# Altium schematic sheet Tran_RF.SchDoc
size A
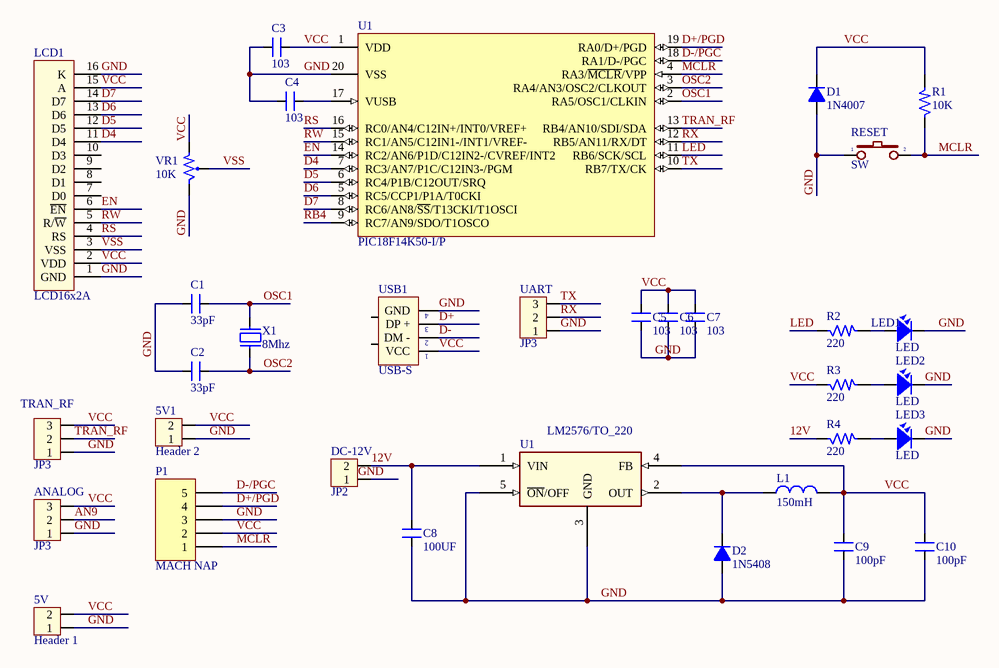
[diagram p0: Tran_RF.SchDoc]

## Parts
(Parts that share a designator on the sheet are numbered #1, #2 ... from top to bottom, then left to right.)
5V  Header 1  [HED2]
5V1  Header 2  [HED2]
ANALOG  JP3  [CON3]
C1  33pF  [SM-0805]
C2  33pF  [SM-0805]
C3  103  [SM-0805]
C4  103  [SM-0805]
C5  103  [SM-0805]
C6  103  [SM-0805]
C7  103  [SM-0805]
C8  100UF  [CP-SMD]
C9  100pF  [CP-SMD]
C10  100pF  [SM-1206]
D1  1N4007  [D1A]
D2  1N5408  [D2AN]
DC-12V  JP2  [CON2]
L1  150mH  [L/0.4]
LCD1  LCD16x2A  [LCD16X2]
LED1  LED  [Led-SMD]
LED2  LED  [Led-SMD]
LED3  LED  [Led-SMD]
P1  MACH NAP  [CON5]
R1  10K  [SM-0805]
R2  220  [SM-0805]
R3  220  [SM-0805]
R4  220  [SM-0805]
RESET  SW  [SW2]
TRAN_RF  JP3  [CON3]
U1#1  PIC18F14K50-I/P  [SOP-20]
U1#2  LM2576/TO_220  [LM2576_SMD]
UART  JP3  [CON3]
USB1  USB-S  [USB-A-RA]
VR1  10K  [VR]
X1  8Mhz  [XT2]

## Nets
12V: C8.2 DC-12V.2 R4.1 U1#2.1(VIN)
AN9: ANALOG.2
D4: LCD1.11(D4) U1#1.7(RC3/AN7/P1C/C12IN3-/PGM)
D5: LCD1.12(D5) U1#1.6(RC4/P1B/C12OUT/SRQ)
D6: LCD1.13(D6) U1#1.5(RC5/CCP1/P1A/T0CKI)
D7: LCD1.14(D7) U1#1.8(RC6/AN8/~{SS}/T13CKI/T1OSCI)
D+: USB1.3(DP_+)
D+/PGD: P1.4 U1#1.19(RA0/D+/PGD)
D-: USB1.2(DM_-)
D-/PGC: P1.5 U1#1.18(RA1/D-/PGC)
EN: LCD1.6(~{EN}) U1#1.14(RC2/AN6/P1D/C12IN2-/CVREF/INT2)
GND: 5V.1 5V1.1 ANALOG.1 C1.1 C2.1 C3.1 C4.1 C5.1 C6.1 C7.1 C8.1 C9.1 C10.1 D1.1(A) D2.1(A) LCD1.1(GND) LCD1.16(K) LED1.2 LED2.2 LED3.2 P1.3 RESET.1 TRAN_RF.1 U1#1.20(VSS) U1#2.3(GND) U1#2.5(~{ON}/OFF) UART.1 USB1.4(GND) VR1.3
LED: R2.1 U1#1.11(RB6/SCK/SCL)
MCLR: P1.1 R1.1 RESET.2 U1#1.4(RA3/~{MCLR}/VPP)
OSC1: C1.2 U1#1.2(RA5/OSC1/CLKIN) X1.2
OSC2: C2.2 U1#1.3(RA4/AN3/OSC2/CLKOUT) X1.1
RB4: U1#1.9(RC7/AN9/SDO/T1OSCO)
RS: LCD1.4(RS) U1#1.16(RC0/AN4/C12IN+/INT0/VREF+)
RW: LCD1.5(R/~{W}) U1#1.15(RC1/AN5/C12IN1-/INT1/VREF-)
RX: U1#1.12(RB5/AN11/RX/DT) UART.2
TRAN_RF: TRAN_RF.2 U1#1.13(RB4/AN10/SDI/SDA)
TX: U1#1.10(RB7/TX/CK) UART.3
VCC: 5V.2 5V1.2 ANALOG.3 C3.2 C5.2 C6.2 C7.2 C9.2 C10.2 D1.2(K) L1.2 LCD1.2(VDD) LCD1.15(A) P1.2 R1.2 R3.1 TRAN_RF.3 U1#1.1(VDD) U1#2.4(FB) USB1.1(VCC) VR1.1
VSS: LCD1.3(VSS) VR1.2
NetC4_2: C4.2 U1#1.17(VUSB)
NetD2_2: D2.2(K) L1.1 U1#2.2(OUT)
NetLED1_1: LED1.1 R2.2
NetLED2_1: LED2.1 R3.2
NetLED3_1: LED3.1 R4.2

Not connected (* = marked no-connect by the designer): DC-12V 1; LCD1 7(D0) 8(D1) 9(D2) 10(D3); USB1 5 6

## Notes on the sheet
- Labels drawn without touching a wire or pin: GND

## Library data of the parts
5V 5V1 = Hed2: Header 2 (Green); Value: Header 2
ANALOG TRAN_RF UART = Con3: Connector 3; Value: Connector 3
C1 C2 = CM: Cap SMD; Value: 103
C3-C7 = CM: Cap SMD; Value: 103
C8 = CN1: Cap np  1pF - 472pF; Value: 100pF
C9 C10 = CN1: Cap np  1pF - 472pF; Value: 100pF
D1 = D1A: Diode 1A; Value: 1N4007
D2 = D5A: Diode 5A; Value: 1N5408
DC-12V = Con2: Connector 2; Value: Connector 2
L1 = L1: Inductor; Value: 150 mH
LCD1 = LCD16x2: LCD dipslay 16 char, 2 line; Value: LCD16x2A
LED1-LED3 = LED: LED Single colour Green and Red; Value: LED 3 ly Single Colour
P1 = Header 5H: Header, 5-Pin, Right Angle; LatestRevisionDate: 17-Jul-2002; LatestRevisionNote: Re-released for DXP Platform.; Publisher: Altium Limited
R1-R4 = R: Resistor 1/4W; Value: R1/4W - 1K
RESET = SW2: Switch button 2 pin; Value: SW chip 2 pin
U1#1 = PIC18F14K50-I/P: USB Flash Microcontroller with nanoWatt XLP Technology, 20-pin PDIP, Industrial Temperature; FirstPublished: 2-Dec-2009; DatasheetVersion: revC, Mar-2009; PackageVersion: revBB, Aug-2009; PackageReference: PDIP300-P20; Publisher: Altium Limited; PackageDescription: 20-Lead Plastic Dual In-Line (P) - 300 mil Body [PDIP]; Supplier 1: Digi-Key; Supplier Part Number 1: PIC18F14K50-I/P-ND; Supplier 2: Farnell; Supplier Part Number 2: 1648501; Supplier 3: Newark; Supplier Part Number 3: 77M3103; ComponentLink1Description: Datasheet; ComponentLink1URL: http://ww1.microchip.com/downloads/en/DeviceDoc/41350C.pdf; ComponentLink2Description: Packaging Specification; ComponentLink2URL: http://www.microchip.com/stellent/groups/techpub_sg/documents/packagingspec/en012702.pdf; ComponentLink3Description: Microchip.com Home; ComponentLink3URL: http://www.microchip.com/
USB1 = USB_S: USB connector; Value: USB
VR1 = VR1: Var Resistor; Value: VR 10K
X1 = XT2: Crystal For all Crystal 2pin.; Value: 4Mhz